# Altium schematic sheet debouncers.SchDoc: Debouncer Circuits
size Letter; Organization: Midnight Sun Solar Rayce Car Team; Address1: University of Waterloo; Address2: 200 University Ave W; Address3: Waterloo, ON, Canada; Address4: N2L 3E9; Revision: 1.0; SheetNumber: 3; SheetTotal: 3; Website: www.uwmidsun.com
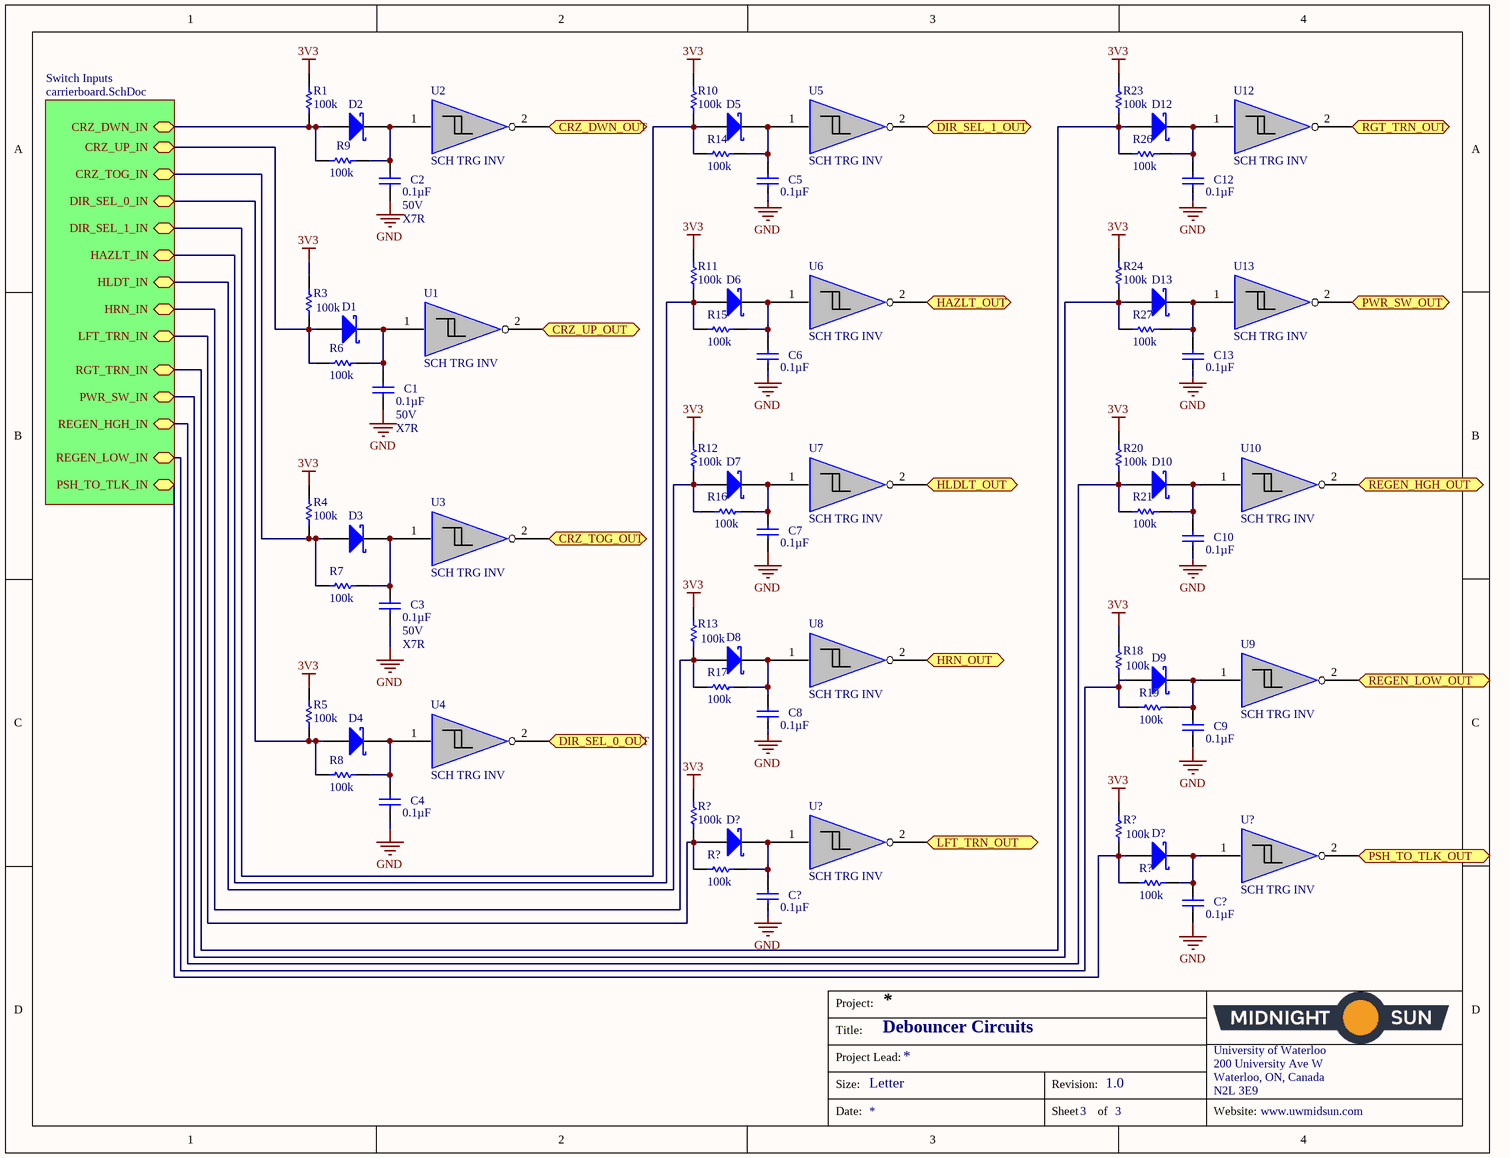
[diagram p0: debouncers.SchDoc]

## Parts
(Parts that share a designator on the sheet are numbered #1, #2 ... from top to bottom, then left to right.)
C1  Capacitance: 0.1µF  Voltage: 50V  Temperature Coefficient: X7R  [CAP, 0603]  (hidden comment: CAP CER 0.1UF 50V 10% X7R 0603)
C2  Capacitance: 0.1µF  Voltage: 50V  Temperature Coefficient: X7R  [CAP, 0603]  (hidden comment: CAP CER 0.1UF 50V 10% X7R 0603)
C3  Capacitance: 0.1µF  Voltage: 50V  Temperature Coefficient: X7R  [CAP, 0603]  (hidden comment: CAP CER 0.1UF 50V 10% X7R 0603)
C4  Capacitance: 0.1µF  [CAP, 0603]  (hidden comment: CAP CER 0.1UF 50V 10% X7R 0603)
C5  Capacitance: 0.1µF  [CAP, 0603]  (hidden comment: CAP CER 0.1UF 50V 10% X7R 0603)
C6  Capacitance: 0.1µF  [CAP, 0603]  (hidden comment: CAP CER 0.1UF 50V 10% X7R 0603)
C7  Capacitance: 0.1µF  [CAP, 0603]  (hidden comment: CAP CER 0.1UF 50V 10% X7R 0603)
C8  Capacitance: 0.1µF  [CAP, 0603]  (hidden comment: CAP CER 0.1UF 50V 10% X7R 0603)
C9  Capacitance: 0.1µF  [CAP, 0603]  (hidden comment: CAP CER 0.1UF 50V 10% X7R 0603)
C10  Capacitance: 0.1µF  [CAP, 0603]  (hidden comment: CAP CER 0.1UF 50V 10% X7R 0603)
C12  Capacitance: 0.1µF  [CAP, 0603]  (hidden comment: CAP CER 0.1UF 50V 10% X7R 0603)
C13  Capacitance: 0.1µF  [CAP, 0603]  (hidden comment: CAP CER 0.1UF 50V 10% X7R 0603)
C?#1  Capacitance: 0.1µF  [CAP, 0603]  (hidden comment: CAP CER 0.1UF 50V 10% X7R 0603)
C?#2  Capacitance: 0.1µF  [CAP, 0603]  (hidden comment: CAP CER 0.1UF 50V 10% X7R 0603)
D1  DIODE SCHOTTKY 60V 3A SMA  [SMA]  (value not drawn)
D2  DIODE SCHOTTKY 60V 3A SMA  [SMA]  (value not drawn)
D3  DIODE SCHOTTKY 60V 3A SMA  [SMA]  (value not drawn)
D4  DIODE SCHOTTKY 60V 3A SMA  [SMA]  (value not drawn)
D5  DIODE SCHOTTKY 60V 3A SMA  [SMA]  (value not drawn)
D6  DIODE SCHOTTKY 60V 3A SMA  [SMA]  (value not drawn)
D7  DIODE SCHOTTKY 60V 3A SMA  [SMA]  (value not drawn)
D8  DIODE SCHOTTKY 60V 3A SMA  [SMA]  (value not drawn)
D9  DIODE SCHOTTKY 60V 3A SMA  [SMA]  (value not drawn)
D10  DIODE SCHOTTKY 60V 3A SMA  [SMA]  (value not drawn)
D12  DIODE SCHOTTKY 60V 3A SMA  [SMA]  (value not drawn)
D13  DIODE SCHOTTKY 60V 3A SMA  [SMA]  (value not drawn)
D?#1  DIODE SCHOTTKY 60V 3A SMA  [SMA]  (value not drawn)
D?#2  DIODE SCHOTTKY 60V 3A SMA  [SMA]  (value not drawn)
R1  Resistance: 100k  [RES, 0603]  (hidden comment: RES 100K OHM 5% 1/8W 0603)
R3  Resistance: 100k  [RES, 0603]  (hidden comment: RES 100K OHM 5% 1/8W 0603)
R4  Resistance: 100k  [RES, 0603]  (hidden comment: RES 100K OHM 5% 1/8W 0603)
R5  Resistance: 100k  [RES, 0603]  (hidden comment: RES 100K OHM 5% 1/8W 0603)
R6  Resistance: 100k  [RES, 0603]  (hidden comment: RES 100K OHM 5% 1/8W 0603)
R7  Resistance: 100k  [RES, 0603]  (hidden comment: RES 100K OHM 5% 1/8W 0603)
R8  Resistance: 100k  [RES, 0603]  (hidden comment: RES 100K OHM 5% 1/8W 0603)
R9  Resistance: 100k  [RES, 0603]  (hidden comment: RES 100K OHM 5% 1/8W 0603)
R10  Resistance: 100k  [RES, 0603]  (hidden comment: RES 100K OHM 5% 1/8W 0603)
R11  Resistance: 100k  [RES, 0603]  (hidden comment: RES 100K OHM 5% 1/8W 0603)
R12  Resistance: 100k  [RES, 0603]  (hidden comment: RES 100K OHM 5% 1/8W 0603)
R13  Resistance: 100k  [RES, 0603]  (hidden comment: RES 100K OHM 5% 1/8W 0603)
R14  Resistance: 100k  [RES, 0603]  (hidden comment: RES 100K OHM 5% 1/8W 0603)
R15  Resistance: 100k  [RES, 0603]  (hidden comment: RES 100K OHM 5% 1/8W 0603)
R16  Resistance: 100k  [RES, 0603]  (hidden comment: RES 100K OHM 5% 1/8W 0603)
R17  Resistance: 100k  [RES, 0603]  (hidden comment: RES 100K OHM 5% 1/8W 0603)
R18  Resistance: 100k  [RES, 0603]  (hidden comment: RES 100K OHM 5% 1/8W 0603)
R19  Resistance: 100k  [RES, 0603]  (hidden comment: RES 100K OHM 5% 1/8W 0603)
R20  Resistance: 100k  [RES, 0603]  (hidden comment: RES 100K OHM 5% 1/8W 0603)
R21  Resistance: 100k  [RES, 0603]  (hidden comment: RES 100K OHM 5% 1/8W 0603)
R23  Resistance: 100k  [RES, 0603]  (hidden comment: RES 100K OHM 5% 1/8W 0603)
R24  Resistance: 100k  [RES, 0603]  (hidden comment: RES 100K OHM 5% 1/8W 0603)
R26  Resistance: 100k  [RES, 0603]  (hidden comment: RES 100K OHM 5% 1/8W 0603)
R27  Resistance: 100k  [RES, 0603]  (hidden comment: RES 100K OHM 5% 1/8W 0603)
R?#1  Resistance: 100k  [RES, 0603]  (hidden comment: RES 100K OHM 5% 1/8W 0603)
R?#2  Resistance: 100k  [RES, 0603]  (hidden comment: RES 100K OHM 5% 1/8W 0603)
R?#3  Resistance: 100k  [RES, 0603]  (hidden comment: RES 100K OHM 5% 1/8W 0603)
R?#4  Resistance: 100k  [RES, 0603]  (hidden comment: RES 100K OHM 5% 1/8W 0603)
U1  SCH TRG INV
U2  SCH TRG INV
U3  SCH TRG INV
U4  SCH TRG INV
U5  SCH TRG INV
U6  SCH TRG INV
U7  SCH TRG INV
U8  SCH TRG INV
U9  SCH TRG INV
U10  SCH TRG INV
U12  SCH TRG INV
U13  SCH TRG INV
U?#1  SCH TRG INV
U?#2  SCH TRG INV

## Sub-sheets
Switch Inputs = carrierboard.SchDoc: CRZ_DWN_IN, CRZ_UP_IN, CRZ_TOG_IN, DIR_SEL_0_IN, DIR_SEL_1_IN, HAZLT_IN, HLDT_IN, HRN_IN, LFT_TRN_IN, RGT_TRN_IN, PWR_SW_IN, REGEN_HGH_IN, REGEN_LOW_IN, PSH_TO_TLK_IN

## Ports
CRZ_DWN_OUT, CRZ_TOG_OUT, CRZ_UP_OUT, DIR_SEL_0_OUT, DIR_SEL_1_OUT, HAZLT_OUT, HLDLT_OUT, HRN_OUT, LFT_TRN_OUT, PSH_TO_TLK_OUT, PWR_SW_OUT, REGEN_HGH_OUT, REGEN_LOW_OUT, RGT_TRN_OUT

## Nets
3V3: R1.1 R3.1 R4.1 R5.1 R10.1 R11.1 R12.1 R13.1 R18.1 R20.1 R23.1 R24.1 R?#1.1 R?#2.1
GND: C1.2 C2.2 C3.2 C4.2 C5.2 C6.2 C7.2 C8.2 C9.2 C10.2 C12.2 C13.2 C?#1.2 C?#2.2
CRZ_DWN_OUT: U2.2 ; port CRZ_DWN_OUT
CRZ_TOG_OUT: U3.2 ; port CRZ_TOG_OUT
CRZ_UP_OUT: U1.2 ; port CRZ_UP_OUT
DIR_SEL_0_OUT: U4.2 ; port DIR_SEL_0_OUT
DIR_SEL_1_OUT: U5.2 ; port DIR_SEL_1_OUT
HAZLT_OUT: U6.2 ; port HAZLT_OUT
HLDLT_OUT: U7.2 ; port HLDLT_OUT
HRN_OUT: U8.2 ; port HRN_OUT
LFT_TRN_OUT: U?#1.2 ; port LFT_TRN_OUT
PSH_TO_TLK_OUT: U?#2.2 ; port PSH_TO_TLK_OUT
PWR_SW_OUT: U13.2 ; port PWR_SW_OUT
REGEN_HGH_OUT: U10.2 ; port REGEN_HGH_OUT
REGEN_LOW_OUT: U9.2 ; port REGEN_LOW_OUT
RGT_TRN_OUT: U12.2 ; port RGT_TRN_OUT
NetC1_1: C1.1 D1.2 R6.2 U1.1
NetC2_1: C2.1 D2.2 R9.2 U2.1
NetC3_1: C3.1 D3.2 R7.2 U3.1
NetC4_1: C4.1 D4.2 R8.2 U4.1
NetC5_1: C5.1 D5.2 R14.2 U5.1
NetC6_1: C6.1 D6.2 R15.2 U6.1
NetC7_1: C7.1 D7.2 R16.2 U7.1
NetC8_1: C8.1 D8.2 R17.2 U8.1
NetC9_1: C9.1 D9.2 R19.2 U9.1
NetC10_1: C10.1 D10.2 R21.2 U10.1
NetC12_1: C12.1 D12.2 R26.2 U12.1
NetC13_1: C13.1 D13.2 R27.2 U13.1
NetC?#1_1: C?#1.1 D?#1.2 R?#3.2 U?#1.1
NetC?#2_1: C?#2.1 D?#2.2 R?#4.2 U?#2.1
NetD1_1: D1.1 R3.2 R6.1 ; sheet Switch Inputs/CRZ_UP_IN
NetD2_1: D2.1 R1.2 R9.1 ; sheet Switch Inputs/CRZ_DWN_IN
NetD3_1: D3.1 R4.2 R7.1 ; sheet Switch Inputs/CRZ_TOG_IN
NetD4_1: D4.1 R5.2 R8.1 ; sheet Switch Inputs/DIR_SEL_0_IN
NetD5_1: D5.1 R10.2 R14.1 ; sheet Switch Inputs/DIR_SEL_1_IN
NetD6_1: D6.1 R11.2 R15.1 ; sheet Switch Inputs/HAZLT_IN
NetD7_1: D7.1 R12.2 R16.1 ; sheet Switch Inputs/HLDT_IN
NetD8_1: D8.1 R13.2 R17.1 ; sheet Switch Inputs/HRN_IN
NetD9_1: D9.1 R18.2 R19.1 ; sheet Switch Inputs/REGEN_LOW_IN
NetD10_1: D10.1 R20.2 R21.1 ; sheet Switch Inputs/REGEN_HGH_IN
NetD12_1: D12.1 R23.2 R26.1 ; sheet Switch Inputs/RGT_TRN_IN
NetD13_1: D13.1 R24.2 R27.1 ; sheet Switch Inputs/PWR_SW_IN
NetD?#1_1: D?#1.1 R?#1.2 R?#3.1 ; sheet Switch Inputs/LFT_TRN_IN
NetD?#2_1: D?#2.1 R?#2.2 R?#4.1 ; sheet Switch Inputs/PSH_TO_TLK_IN

## Notes on the sheet
- Project:
- Title:
- Size:
- Project Lead:
- Letter
- Revision:
- University of Waterloo
- 200 University Ave W
- Waterloo, ON, Canada
- N2L 3E9
- Date:
- Sheet
- of
- Website:

## Library data of the parts
C1-C10 C12 C13 C?#1 C?#2 = CAP CER 0.1UF 50V 10% X7R 0603: 0.10µF ±10% 50V Ceramic Capacitor X7R 0603 (1608 Metric); Manufacturer 1: AVX Corporation; Manufacturer Part Number 1: 06035C104KAT2A; Supplier 1: Digi-Key; Supplier Part Number 1: 478-5052-1-ND; Packaging: Cut Tape (CT); Part Status: Active; Operating Temperature: -55°C ~ 125°C; Ratings: -; Mounting Type: Surface Mount, MLCC; Package / Case: 0603 (1608 Metric); Size / Dimension: 0.063" L x 0.032" W (1.60mm x 0.81mm); Height - Seated (Max): -; Thickness (Max): 0.035" (0.90mm); Lead Spacing: -; Lead Style: -; ComponentLink1URL: http://datasheets.avx.com/X7RDielectric.pdf; ComponentLink1Description: http://datasheets.avx.com/X7RDielectric.pdf; Tolerance: ±10%
  C4-C10 C12 C13 C?#1 C?#2: Voltage: 50V; Temperature Coefficient: X7R
D1-D10 D12 D13 D?#1 D?#2 = DIODE SCHOTTKY 60V 3A SMA: Diode Schottky 60V 3A Surface Mount SMA; Manufacturer 1: Diodes Incorporated; Manufacturer Part Number 1: B360A-13-F; Voltage - Forward (Vf) (Max) @ If: 700mV @ 3A; Speed: Fast Recovery =< 500ns, > 200mA (Io); Current - Reverse Leakage @ Vr: 500µA @ 60V; Capacitance @ Vr, F: 200pF @ 4V, 1MHz; Supplier 1: Digi-Key; Supplier Part Number 1: B360A-FDICT-ND; Packaging: Cut Tape (CT); Part Status: Active; Diode Type: Schottky; Mounting Type: Surface Mount; Package / Case: DO-214AC, SMA; Supplier Device Package: SMA; Operating Temperature - Junction: -55°C ~ 150°C; ComponentLink1URL: https://www.diodes.com/assets/Datasheets/ds30891.pdf; ComponentLink1Description: https://www.diodes.com/assets/Datasheets/ds30891.pdf; Voltage - DC Reverse (Vr) (Max): 60V; Current - Average Rectified (Io): 3A
R1 R3-R21 R23 R24 R26 R27 R?#1-R?#4 = RES 100K OHM 5% 1/8W 0603: RES SMD 100K OHM 5% 1/10W 0603; Manufacturer 1: Yageo; Manufacturer Part Number 1: RC0603JR-07100KL; Temperature Coefficient: ±100ppm/°C; Supplier 1: Digi-Key; Supplier Part Number 1: 311-100KGRCT-ND; Packaging: Cut Tape (CT); Part Status: Active; Composition: Thick Film; Operating Temperature: -55°C ~ 155°C; Package / Case: 0603 (1608 Metric); Supplier Device Package: 0603; Size / Dimension: 0.063" L x 0.031" W (1.60mm x 0.80mm); Height - Seated (Max): 0.022" (0.55mm); Failure Rate: -; ComponentLink1URL: http://www.yageo.com/documents/recent/PYu-RC_Group_51_RoHS_L_7.pdf; ComponentLink1Description: http://www.yageo.com/documents/recent/PYu-RC_Group_51_RoHS_L_7.pdf; Tolerance: ±5%; Power: 1/10W
U1-U10 U12 U13 U?#1 U?#2 = SCH TRG INV: Schmitt Trigger Inverting Generic